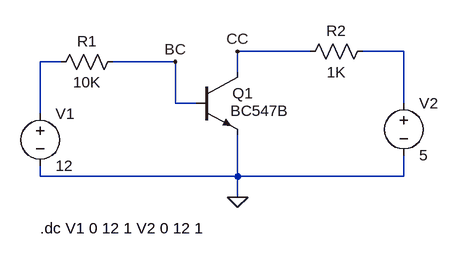
[diagram p0: schematic npn BJT.asc]
npn BJT.asc, the LTspice schematic file:
Version 4
SHEET 1 880 680
WIRE 416 48 304 48
WIRE 560 48 496 48
WIRE 32 64 0 64
WIRE 208 64 112 64
WIRE 304 80 304 48
WIRE 208 128 208 64
WIRE 240 128 208 128
WIRE 560 128 560 48
WIRE 0 144 0 64
WIRE 0 240 0 224
WIRE 304 240 304 176
WIRE 304 240 0 240
WIRE 560 240 560 208
WIRE 560 240 304 240
WIRE 304 272 304 240
FLAG 304 48 CC
FLAG 208 64 BC
FLAG 304 272 0
SYMBOL voltage 0 128 R0
WINDOW 123 0 0 Left 0
WINDOW 39 0 0 Left 0
SYMATTR InstName V1
SYMATTR Value 12
SYMBOL res 128 48 R90
WINDOW 0 0 56 VBottom 2
WINDOW 3 32 56 VTop 2
SYMATTR InstName R1
SYMATTR Value 10K
SYMBOL res 512 32 R90
WINDOW 0 0 56 VBottom 2
WINDOW 3 32 56 VTop 2
SYMATTR InstName R2
SYMATTR Value 1K
SYMBOL voltage 560 112 R0
WINDOW 123 0 0 Left 0
WINDOW 39 0 0 Left 0
SYMATTR InstName V2
SYMATTR Value 5
SYMBOL npn 240 80 R0
WINDOW 3 53 59 Left 2
SYMATTR Value BC547B
SYMATTR InstName Q1
TEXT 0 320 Left 2 !.dc V1 0 12 1 V2 0 12 1

The netlist it stands for:
* npn BJT.asc
V1 N002 0 12
R1 BC N002 10K
R2 N001 CC 1K
V2 N001 0 5
Q1 CC BC 0 0 BC547B
.model NPN NPN
.model PNP PNP
.lib standard.bjt
.dc V1 0 12 1 V2 0 12 1
.backanno
.end